# Altium schematic sheet power_measure.SchDoc
size A4
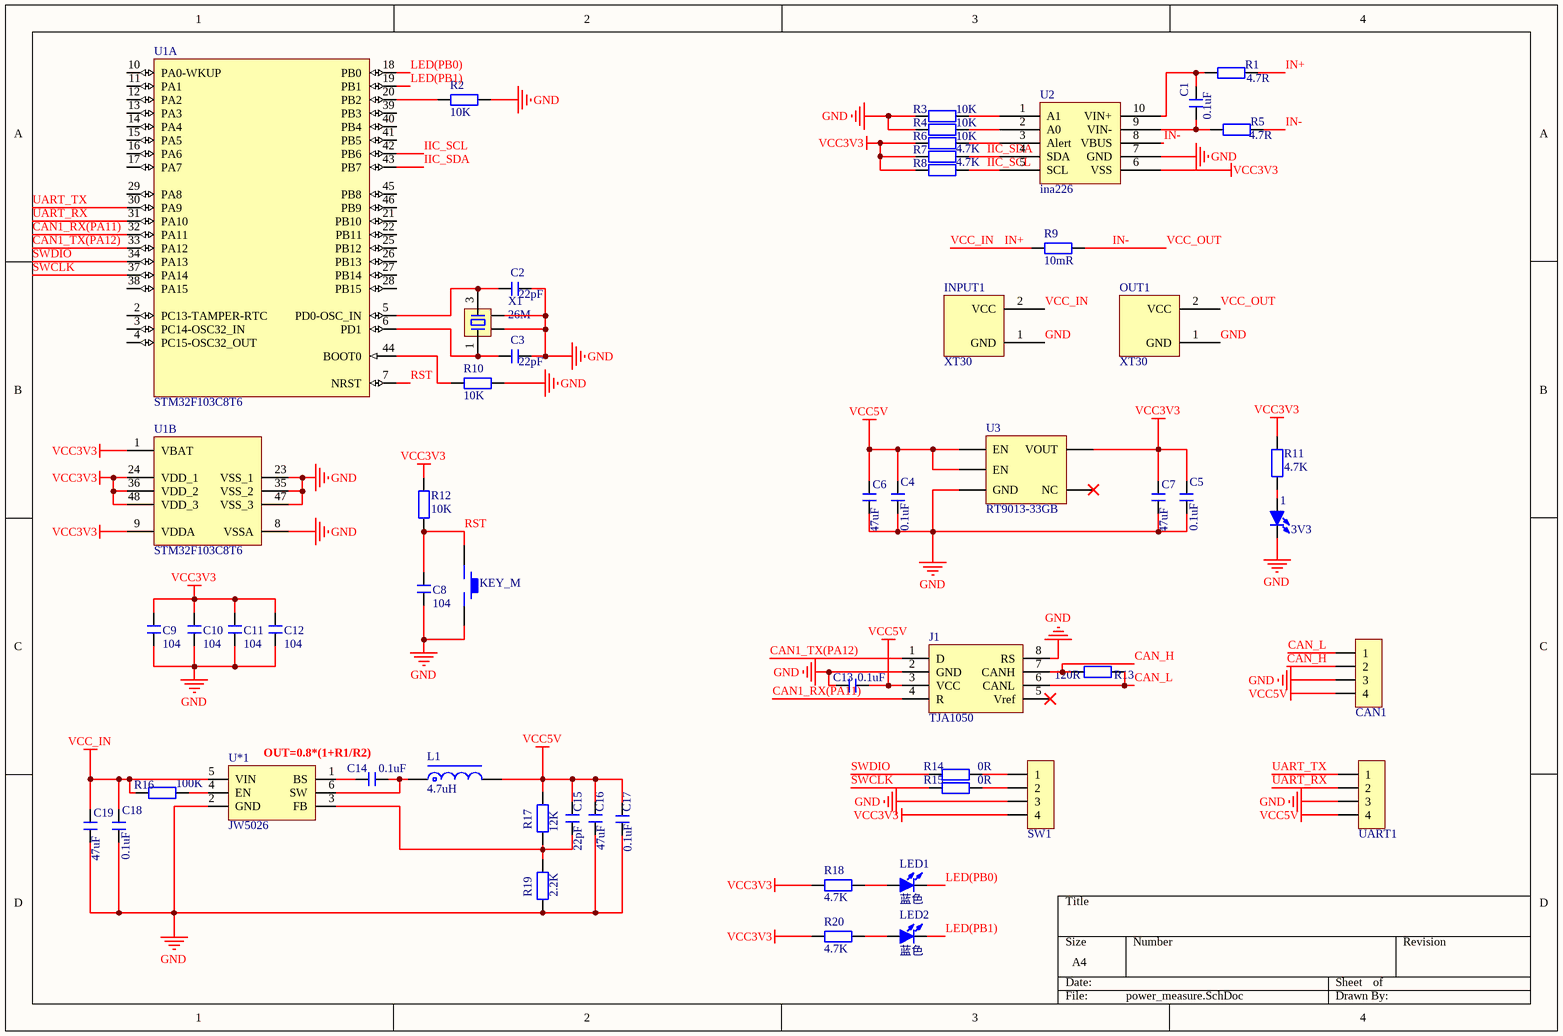
[diagram p0: power_measure.SchDoc]

## Parts
1  3V3  [LED 0805R]
C1  0.1uF  [C 0603_L]
C2  22pF  [C 0603_L]
C3  22pF  [C 0603_L]
C4  0.1uF  [C 0805_L]
C5  0.1uF  [C 0805_L]
C6  47uF  [C 0805_L]
C7  47uF  [C 0805_L]
C8  104  [C 0603_L]
C9  104  [C 0603_L]
C10  104  [C 0603_L]
C11  104  [C 0603_L]
C12  104  [C 0603_L]
C13  0.1uF  [C 0603_L]
C14  0.1uF  [C 0603_L]
C15  22pF  [C 0603_L]
C16  47uF  [C 0805_L]
C17  0.1uF  [C 0805_L]
C18  0.1uF  [C 0805_L]
C19  47uF  [C 0805_L]
CAN1  HDR-1X4  [MX 1.25-WS-4P]  (value not drawn)
INPUT1  XT30  [XT30PW-M]
J1  TJA1050  [SOIC-8_150mil]
L1  4.7uH  [CD53]
LED1  蓝色  [LED 0805B]
LED2  蓝色  [LED 0805B]
OUT1  XT30  [XT30PW-F]
R1  4.7R  [R 0603_L]
R2  10K  [R 0603_L]
R3  10K  [R 0603_L]
R4  10K  [R 0603_L]
R5  4.7R  [R 0603_L]
R6  10K  [R 0603_L]
R7  4.7K  [R 0603_L]
R8  4.7K  [R 0603_L]
R9  10mR  [R 2512_M]
R10  10K  [R 0603_L]
R11  4.7K  [R 0603_L]
R12  10K  [R 0603_L]
R13  120R  [R 0603_L]
R14  0R  [R 0603_L]
R15  0R  [R 0603_L]
R16  100K  [R 0603_L]
R17  12K  [R 0603_L]
R18  4.7K  [R 0603_L]
R19  2.2K  [R 0603_L]
R20  4.7K  [R 0603_L]
RST1  KEY_M  [SMD-3.2*4.2]
SW1  HDR-1X4  [MX 1.25-WS-4P]  (value not drawn)
U1  STM32F103C8T6  [LQFP48_N]  (parts A,B of 2)
U2  ina226  [MSOP-10]
U3  RT9013-33GB  [SOT23-5M]
U*1  JW5026  [SOT-23-6_L2.9-W1.6-P0.95-LS2.8-BL]
UART1  HDR-1X4  [MX 1.25-WS-4P]  (value not drawn)
X1  26M  [OSC 3225-4P]

## Nets
GND: 1.2(K) C2.2 C3.2 C4.1 C5.1 C6.1 C7.1 C8.1 C9.1 C10.1 C11.1 C12.1 C13.2 C16.1 C17.1 C18.1 C19.1 CAN1.3 INPUT1.1(GND) J1.2(GND) J1.8(RS) OUT1.1(GND) R2.2 R3.2 R4.2 R10.2 R19.1 RST1.2 SW1.3 U1.8(VSSA) U1.23(VSS_1) U1.35(VSS_2) U1.47(VSS_3) U2.7(GND) U3.2(GND) U*1.2(GND) UART1.3 X1.2 X1.4
IN+: C18.2 C19.2 INPUT1.2(VCC) R1.2 R9.1 R16.2 U*1.5(VIN)  [also labelled VCC_IN]
VCC3V3: C5.2 C7.2 C9.2 C10.2 C11.2 C12.2 R6.2 R7.2 R8.2 R11.1 R12.2 R18.1 R20.1 SW1.4 U1.1(VBAT) U1.9(VDDA) U1.24(VDD_1) U1.36(VDD_2) U1.48(VDD_3) U2.6(VSS) U3.5(VOUT)
VCC5V: C4.2 C6.2 C13.1 C15.2 C16.2 C17.2 CAN1.4 J1.3(VCC) L1.2 R17.2 U3.1(EN) U3.3(EN) UART1.4
CAN1_RX(PA11): J1.4(R) U1.32(PA11)
CAN1_TX(PA12): J1.1(D) U1.33(PA12)
CAN_H: CAN1.2 J1.7(CANH) R13.1
CAN_L: CAN1.1 J1.6(CANL) R13.2
IIC_SCL: R8.1 U1.42(PB6) U2.5(SCL)
IIC_SDA: R7.1 U1.43(PB7) U2.4(SDA)
IN-: OUT1.2(VCC) R5.2 R9.2 U2.8(VBUS)  [also labelled VCC_OUT]
LED(PB0): LED1.2(K) U1.18(PB0)
LED(PB1): LED2.2(K) U1.19(PB1)
RST: C8.2 R12.1 RST1.1 U1.7(NRST)
SWCLK: R15.1 U1.37(PA14)
SWDIO: R14.1 U1.34(PA13)
UART_RX: U1.31(PA10) UART1.2
UART_TX: U1.30(PA9) UART1.1
Net1_1: 1.1(A) R11.2
NetC1_1: C1.1 R5.1 U2.9(VIN-)
NetC1_2: C1.2 R1.1 U2.10(VIN+)
NetC2_1: C2.1 U1.5(PD0-OSC_IN) X1.3
NetC3_1: C3.1 U1.6(PD1) X1.1
NetC14_1: C14.1 U*1.1(BS)
NetC14_2: C14.2 L1.1 U*1.6(SW)
NetC15_1: C15.1 R17.1 R19.2 U*1.3(FB)
NetLED1_1: LED1.1(A) R18.2
NetLED2_1: LED2.1(A) R20.2
NetR2_1: R2.1 U1.20(PB2)
NetR3_1: R3.1 U2.1(A1)
NetR4_1: R4.1 U2.2(A0)
NetR6_1: R6.1 U2.3(Alert)
NetR10_1: R10.1 U1.44(BOOT0)
NetR14_2: R14.2 SW1.1
NetR15_2: R15.2 SW1.2
NetR16_1: R16.1 U*1.4(EN)

Not connected (* = marked no-connect by the designer): J1 5(Vref)*; U1 2(PC13-TAMPER-RTC) 3(PC14-OSC32_IN) 4(PC15-OSC32_OUT) 10(PA0-WKUP) 11(PA1) 12(PA2) 13(PA3) 14(PA4) 15(PA5) 16(PA6) 17(PA7) 21(PB10) 22(PB11) 25(PB12) 26(PB13) 27(PB14) 28(PB15) 29(PA8) 38(PA15) 39(PB3) 40(PB4) 41(PB5) 45(PB8) 46(PB9); U3 4(NC)*

## Notes on the sheet
- OUT=0.8*(1+R1/R2)

## Library data of the parts
1 LED1 LED2 = LED-SMD: 贴片LED
C1-C19 = C: 贴片电容
CAN1 SW1 UART1 = Header 4: 4P接插件
J1 = TJA1050: CAN芯片
L1 = L-SMD: CD系列贴片线绕功率电感
R1-R20 = R: 贴片电阻
U1 = STM32F103C8T6: STM32 ARM-based 32-bit MCU Performance Line with 64 kB Flash, 20 kB Internal RAM, -40 to +85癈 Temperature, 48-Pin LQFP, Tray; DatasheetVersion: rev13.0, Apr-2011; PackageVersion: rev13, Apr-2011; PackageReference: LQFP48; PackageDescription: 48-Pin Low-Profile Quad Flat Pack, 7 x 7 mm Body, 0.5 mm Pitch (LQFP48); ComponentLink1Description: Manufacturer URL; ComponentLink1URL: http://www.st.com/; ComponentLink2Description: STM32F103 Datasheet; ComponentLink2URL: http://www.st.com/internet/com/TECHNICAL_RESOURCES/TECHNICAL_LITERATURE/DATASHEET/CD00161566.pdf; ComponentLink3Description: STM32 Family Web Page; ComponentLink3URL: www.st.com/stm32; 联系售后: https://shop463601444.taobao.com
U*1 = JW5026 : BUCK、MAX40V
X1 = XTAL-4P: 4脚无源晶振